# Altium project EMG_Electrode_Adapter.PrjPcb
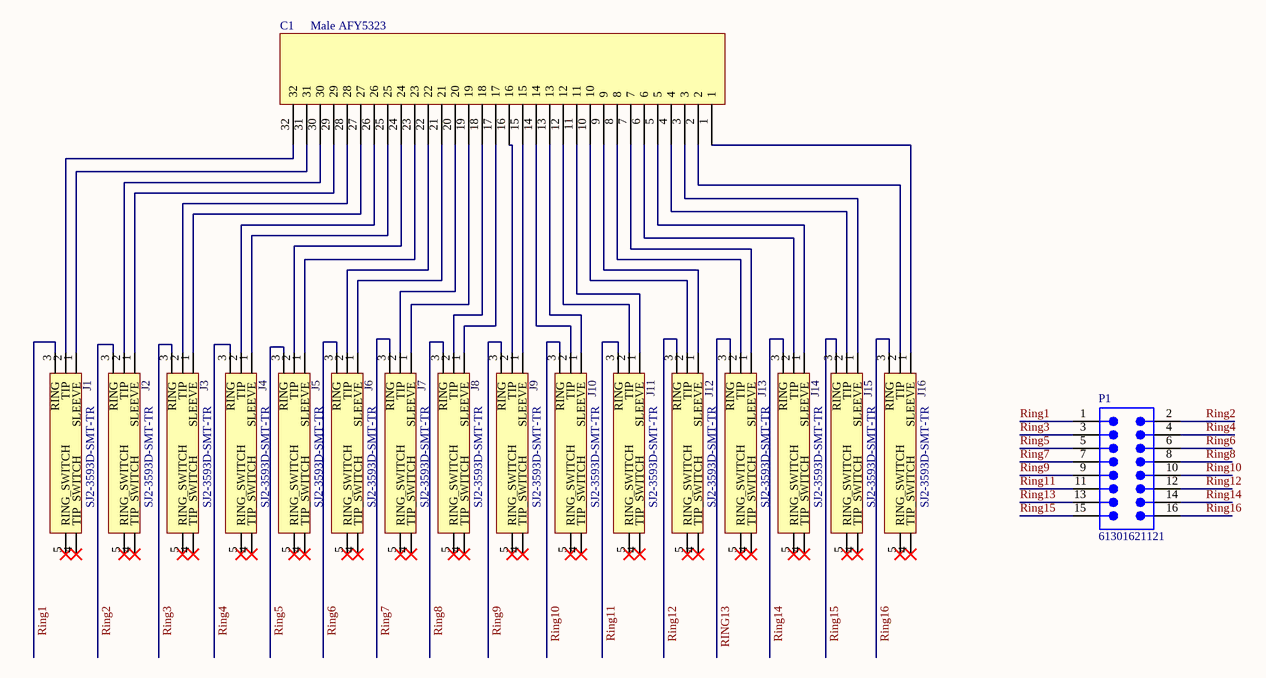
[diagram p0: EMG_Electrode_Adapter.SchDoc]
1 sheet, 18 parts. Net scope: global (net labels, ports and power ports of the same name join across sheets).
Board file: PCB1.PcbDoc

## Sheet EMG_Electrode_Adapter.SchDoc
size A4; SheetNumber: 1; SheetTotal: 1

### Parts
C1  Male AFY5323  [Male AFY5323]
J1  Phone Connectors 3.5mm Audio Jack SMT 3cond Tip/Ring swtch   Source:  Datasheet  [SJ23593DSMTTR]  (value not drawn)
J2  Phone Connectors 3.5mm Audio Jack SMT 3cond Tip/Ring swtch   Source:  Datasheet  [SJ23593DSMTTR]  (value not drawn)
J3  Phone Connectors 3.5mm Audio Jack SMT 3cond Tip/Ring swtch   Source:  Datasheet  [SJ23593DSMTTR]  (value not drawn)
J4  Phone Connectors 3.5mm Audio Jack SMT 3cond Tip/Ring swtch   Source:  Datasheet  [SJ23593DSMTTR]  (value not drawn)
J5  Phone Connectors 3.5mm Audio Jack SMT 3cond Tip/Ring swtch   Source:  Datasheet  [SJ23593DSMTTR]  (value not drawn)
J6  Phone Connectors 3.5mm Audio Jack SMT 3cond Tip/Ring swtch   Source:  Datasheet  [SJ23593DSMTTR]  (value not drawn)
J7  Phone Connectors 3.5mm Audio Jack SMT 3cond Tip/Ring swtch   Source:  Datasheet  [SJ23593DSMTTR]  (value not drawn)
J8  Phone Connectors 3.5mm Audio Jack SMT 3cond Tip/Ring swtch   Source:  Datasheet  [SJ23593DSMTTR]  (value not drawn)
J9  Phone Connectors 3.5mm Audio Jack SMT 3cond Tip/Ring swtch   Source:  Datasheet  [SJ23593DSMTTR]  (value not drawn)
J10  Phone Connectors 3.5mm Audio Jack SMT 3cond Tip/Ring swtch   Source:  Datasheet  [SJ23593DSMTTR]  (value not drawn)
J11  Phone Connectors 3.5mm Audio Jack SMT 3cond Tip/Ring swtch   Source:  Datasheet  [SJ23593DSMTTR]  (value not drawn)
J12  Phone Connectors 3.5mm Audio Jack SMT 3cond Tip/Ring swtch   Source:  Datasheet  [SJ23593DSMTTR]  (value not drawn)
J13  Phone Connectors 3.5mm Audio Jack SMT 3cond Tip/Ring swtch   Source:  Datasheet  [SJ23593DSMTTR]  (value not drawn)
J14  Phone Connectors 3.5mm Audio Jack SMT 3cond Tip/Ring swtch   Source:  Datasheet  [SJ23593DSMTTR]  (value not drawn)
J15  Phone Connectors 3.5mm Audio Jack SMT 3cond Tip/Ring swtch   Source:  Datasheet  [SJ23593DSMTTR]  (value not drawn)
J16  Phone Connectors 3.5mm Audio Jack SMT 3cond Tip/Ring swtch   Source:  Datasheet  [SJ23593DSMTTR]  (value not drawn)
P1  61301621121  [61301621121]

### Nets
Ring1: J1.3(RING) P1.1
Ring2: J2.3(RING) P1.2
Ring3: J3.3(RING) P1.3
Ring4: J4.3(RING) P1.4
Ring5: J5.3(RING) P1.5
Ring6: J6.3(RING) P1.6
Ring7: J7.3(RING) P1.7
Ring8: J8.3(RING) P1.8
Ring9: J9.3(RING) P1.9
Ring10: J10.3(RING) P1.10
Ring11: J11.3(RING) P1.11
Ring12: J12.3(RING) P1.12
RING13: J13.3(RING) P1.13
Ring14: J14.3(RING) P1.14
Ring15: J15.3(RING) P1.15
Ring16: J16.3(RING) P1.16
NetC1_1: C1.1 J16.1(SLEEVE)
NetC1_2: C1.2 J16.2(TIP)
NetC1_3: C1.3 J15.1(SLEEVE)
NetC1_4: C1.4 J15.2(TIP)
NetC1_5: C1.5 J14.1(SLEEVE)
NetC1_6: C1.6 J14.2(TIP)
NetC1_7: C1.7 J13.1(SLEEVE)
NetC1_8: C1.8 J13.2(TIP)
NetC1_9: C1.9 J12.1(SLEEVE)
NetC1_10: C1.10 J12.2(TIP)
NetC1_11: C1.11 J11.1(SLEEVE)
NetC1_12: C1.12 J11.2(TIP)
NetC1_13: C1.13 J10.1(SLEEVE)
NetC1_14: C1.14 J10.2(TIP)
NetC1_15: C1.15 J9.1(SLEEVE)
NetC1_16: C1.16 J9.2(TIP)
NetC1_17: C1.17 J8.1(SLEEVE)
NetC1_18: C1.18 J8.2(TIP)
NetC1_19: C1.19 J7.1(SLEEVE)
NetC1_20: C1.20 J7.2(TIP)
NetC1_21: C1.21 J6.1(SLEEVE)
NetC1_22: C1.22 J6.2(TIP)
NetC1_23: C1.23 J5.1(SLEEVE)
NetC1_24: C1.24 J5.2(TIP)
NetC1_25: C1.25 J4.1(SLEEVE)
NetC1_26: C1.26 J4.2(TIP)
NetC1_27: C1.27 J3.1(SLEEVE)
NetC1_28: C1.28 J3.2(TIP)
NetC1_29: C1.29 J2.1(SLEEVE)
NetC1_30: C1.30 J2.2(TIP)
NetC1_31: C1.31 J1.1(SLEEVE)
NetC1_32: C1.32 J1.2(TIP)

Not connected (* = marked no-connect by the designer): J1 4(TIP_SWITCH)* 5(RING_SWITCH)*; J2 4(TIP_SWITCH)* 5(RING_SWITCH)*; J3 4(TIP_SWITCH)* 5(RING_SWITCH)*; J4 4(TIP_SWITCH)* 5(RING_SWITCH)*; J5 4(TIP_SWITCH)* 5(RING_SWITCH)*; J6 4(TIP_SWITCH)* 5(RING_SWITCH)*; J7 4(TIP_SWITCH)* 5(RING_SWITCH)*; J8 4(TIP_SWITCH)* 5(RING_SWITCH)*; J9 4(TIP_SWITCH)* 5(RING_SWITCH)*; J10 4(TIP_SWITCH)* 5(RING_SWITCH)*; J11 4(TIP_SWITCH)* 5(RING_SWITCH)*; J12 4(TIP_SWITCH)* 5(RING_SWITCH)*; J13 4(TIP_SWITCH)* 5(RING_SWITCH)*; J14 4(TIP_SWITCH)* 5(RING_SWITCH)*; J15 4(TIP_SWITCH)* 5(RING_SWITCH)*; J16 4(TIP_SWITCH)* 5(RING_SWITCH)*

### Library data of the parts
J1-J16 = SJ2-3593D-SMT-TR: Manufacturer_Name: CUI Devices; GateName_1: G$1; SymbolName_1: SJ2-3593D-SMT-TR; LibraryName: SJ2-3593D-SMT-TR; DeviceSetName: SJ2-3593D-SMT-TR; Package: SJ23593DSMTTR; Manufacturer_Part_Number: SJ2-3593D-SMT-TR; Mouser_Part_Number: 490-SJ2-3593D-SMT-TR; Mouser_Price-Stock: https://www.mouser.co.uk/ProductDetail/CUI-Devices/SJ2-3593D-SMT-TR?qs=DXv0QSHKF4wWj2AnIqZJhQ%3D%3D; Arrow_Part_Number: SJ2-3593D-SMT-TR; Arrow_Price-Stock: https://www.arrow.com/en/products/sj2-3593d-smt-tr/cui-devices?region=nac; Height: 5.1mm; Supplier 1: Arrow Electronics; Supplier Part Number 1: SJ2-3593D-SMT-TR
P1 = CMP-1502-01097-2: NexarPartId: 32855550; Connector Type: Male Pin; Gender: Male; Row Spacing: 2.54mm; Voltage Rating: 250V; Number of Contacts: 16; Contact Resistance: 20mΩ; Current Rating: 3A; Contact Plating: Gold; Max Operating Temperature: 105°C; Contact Mating Length: 5.9944mm; Termination: Solder; REACH SVHC: Unknown; Height: 8.89mm; RoHS: Compliant; Orientation: Vertical; Number of Pins: 16; Packaging: Bulk; Number of Rows: 2; Mount: Through Hole; Contact Material: Copper; Number of Positions: 16; Min Operating Temperature: -40°C; Operating Supply Voltage: 250V; Pitch: 2.54mm; Lead Pitch: 2.54mm; Color: Black